# Altium schematic sheet SCH_MODULO_GPS.SchDoc
size A4
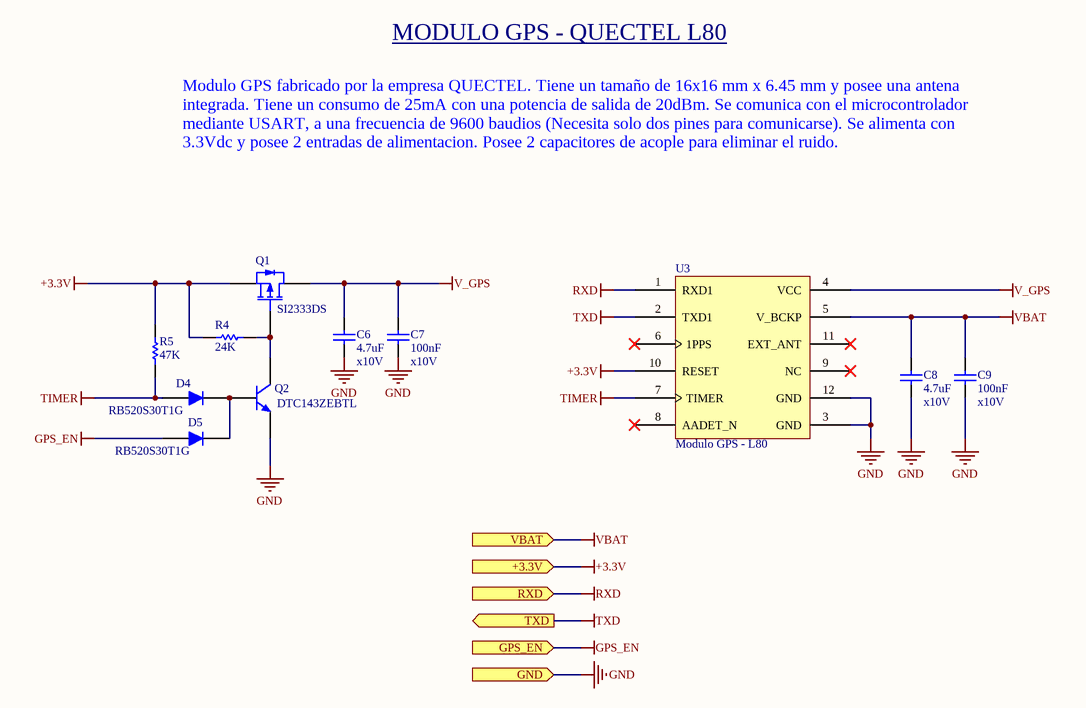
[diagram p0: SCH_MODULO_GPS.SchDoc]

## Parts
C6  value 4.7uF  Voltage: x10V  [RAD-0.3]  (hidden comment: Capacitor - Común)
C7  value 100nF  Voltage: x10V  [RAD-0.3]  (hidden comment: Capacitor - Común)
C8  value 4.7uF  Voltage: x10V  [RAD-0.3]  (hidden comment: Capacitor - Común)
C9  value 100nF  Voltage: x10V  [RAD-0.3]  (hidden comment: Capacitor - Común)
D4  RB520S30T1G  [SMC]
D5  RB520S30T1G  [SMC]
Q1  SI2333DS  [E3]
Q2  DTC143ZEBTL  [TO-92A]
R4  value 24K  [AXIAL-0.5]  (hidden comment: Resistencia - Común)
R5  value 47K  [AXIAL-0.5]  (hidden comment: Resistencia - Común)
U3  Modulo GPS - L80

## Ports
+3.3V (in), GND (in), GPS_EN (in), RXD (in), TXD (out), VBAT (in)

## Nets
+3.3V: Q1.3(S) R4.1 R5.2 U3.10(RESET) ; port +3.3V
GND: C6.1 C7.1 C8.1 C9.1 Q2.1(E) U3.3(GND) U3.12(GND) ; port GND
GPS_EN: D5.1(A) ; port GPS_EN
RXD: U3.1(RXD1) ; port RXD
TIMER: D4.1(A) R5.1 U3.7(TIMER)
TXD: U3.2(TXD1) ; port TXD
V_GPS: C6.2 C7.2 Q1.1(D) U3.4(VCC)
VBAT: C8.2 C9.2 U3.5(V_BCKP) ; port VBAT
NetD4_2: D4.2(K) D5.2(K) Q2.2(B)
NetQ1_2: Q1.2(G) Q2.3(C) R4.2

Not connected (* = marked no-connect by the designer): U3 6(1PPS)* 8(AADET_N)* 9(NC)* 11(EXT_ANT)*

## Notes on the sheet
- MODULO GPS - QUECTEL L80
- Modulo GPS fabricado por la empresa QUECTEL. Tiene un tamaño de 16x16 mm x 6.45 mm y posee una antena integrada. Tiene un consumo de 25mA con una potencia de salida de 20dBm. Se comunica con el microcontrolador mediante USART, a una frecuencia de 9600 baudios (Necesita solo dos pines para comunicarse). Se alimenta con 3.3Vdc y posee 2 entradas de alimentacion. Posee 2 capacitores de acople para eliminar el ruido.
- 27/06/20
- Fecha
- Cambio Formulario
- Emision Inicial
- Versión
- 00
- Producto
- Código
- Cambio Circuito Eléctrico
- CI N°
- Nivel
- UBM:
- Revisó
- Cód. Formulario
- Realizó
- 1
- PF-ID-014-P
- Aprobó
- Vigencia
- COPIA NO CONTROLADA AL IMPRIMIR
- 15/05/2016
- A4
- Cargo
- 1/1

## Library data of the parts
C6-C9 = Capacitor - Común: Capacitor; Published: 8-Jun-2000; LatestRevisionDate: 17-Jul-2002; LatestRevisionNote: Re-released for DXP Platform.; PackageReference: RAD-0.3; Publisher: Altium Limited; PackageDescription: Radial Cap, Thru-Hole; 2 Leads; 0.3 in Pin Spacing
D4 D5 = Diodo - Común: Default Diode; Published: 8-Jun-2000; LatestRevisionDate: 17-Jul-2002; LatestRevisionNote: Re-released for DXP Platform.; PackageVersion: Sep-1996; PackageReference: SMC; Publisher: Altium Limited; PackageDescription: DO-214-AB/SMC; 2 C-Bend Leads; Body 7.9 x 5.9 mm, inc. leads (LxW); Code_JEDEC: DO-214-AB
Q1 = Transistor - MOS/P: P-Channel MOSFET; Published: 8-Jun-2000; LatestRevisionDate: 17-Jul-2002; LatestRevisionNote: Re-released for DXP Platform.; PackageVersion: 1995/1996; PackageReference: E3; Publisher: Altium Limited; PackageDescription: TO, Flat Index; 3 In-Line, Axial Leads; Body Dia. 4.6mm; Lead Dia. 0.5 mm (max)
Q2 = Transistor - NPN: NPN General Purpose Amplifier; Published: 8-Jun-2000; LatestRevisionDate: 15-Jan-2003; LatestRevisionNote: PCB Footprint 'BCY-W3/D4.7' replaced; DatasheetVersion: 1997; PackageVersion: Sep-1998; PackageReference: TO-92A; Publisher: Altium Limited; PackageDescription: TO, Flat Index; 3 In-Line, Axial Leads; Body Dia. 4.5mm; Leads 0.51 x 0.48 mm (max); ComponentLink1Description: Manufacturer Link; ComponentLink1URL: http://www.fairchildsemi.com/; ComponentLink2Description: Datasheet; ComponentLink2URL: http://www.fairchildsemi.com/ds/2N%2F2N3904.pdf
R4 R5 = Resistencia - Común: Semiconductor Resistor; Published: 8-Jun-2000; LatestRevisionDate: 17-Jul-2002; LatestRevisionNote: Re-released for DXP Platform.; PackageReference: AXIAL-0.5; Publisher: Altium Limited; PackageDescription: Axial Device, Thru-Hole; 2 Leads; 0.5 in Pin Spacing
U3 = Modulo GPS - L80: QUECTEL L80